# Altium schematic sheet test1SchDoc.SchDoc
size A4; SheetNumber: 1; SheetTotal: 2
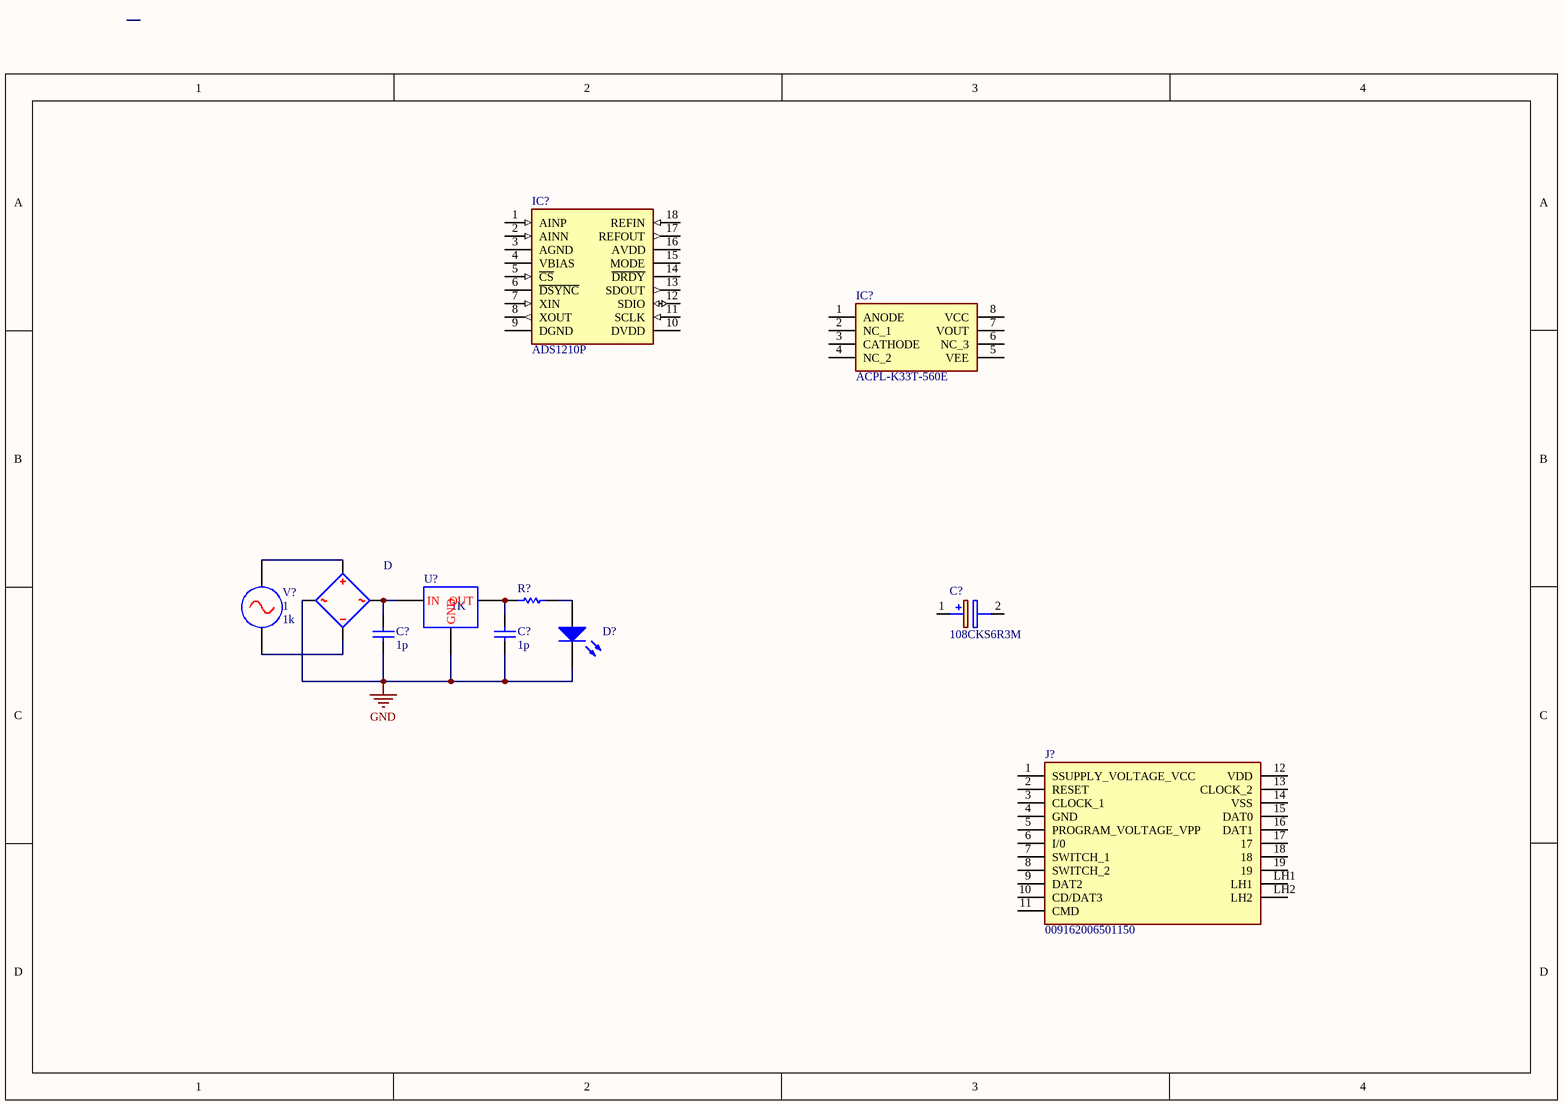
[diagram p0: test1SchDoc.SchDoc]

## Parts
(Parts that share a designator on the sheet are numbered #1, #2 ... from top to bottom, then left to right.)
C?#1  108CKS6R3M  [CAPPRD350W55D850H1300]
C?#2  value 1p  (hidden comment: Capacitor)
C?#3  value 1p  (hidden comment: Capacitor)
D  Four Diodes Bridge Rectifier  (value not drawn)
D?  Light-Emitting Diode  (value not drawn)
IC?#1  ADS1210P  [DIP794W56P254L2286H533Q18N]
IC?#2  ACPL-K33T-560E  [SOIC127P1150X361-8N]
J?  009162006501150  [009162006501150]
R?  value 1K  (hidden comment: Resistor)
U?  Positive Fixed Voltage regulator  (value not drawn)
V?  Amp: 1  Freq: 1k  (hidden comment: AC Voltage Source)

## Nets
GND: C?#2.1 C?#3.1 D.1 D?.2(K) U?.2(GND)
NetC?#2_2: C?#2.2 D.2 U?.1(IN)
NetC?#3_2: C?#3.2 R?.1 U?.3(OUT)
NetD?_1: D?.1(A) R?.2
NetD_3: D.3(POS) V?.1
NetD_4: D.4(NEG) V?.2

Not connected (* = marked no-connect by the designer): C?#1 1(+) 2(-); IC?#1 1(AINP) 2(AINN) 3(AGND) 4(VBIAS) 5(~{CS}) 6(~{DSYNC}) 7(XIN) 8(XOUT) 9(DGND) 10(DVDD) 11(SCLK) 12(SDIO) 13(SDOUT) 14(~{DRDY}) 15(MODE) 16(AVDD) 17(REFOUT) 18(REFIN); IC?#2 1(ANODE) 2(NC_1) 3(CATHODE) 4(NC_2) 5(VEE) 6(NC_3) 7(VOUT) 8(VCC); J? 1(SSUPPLY_VOLTAGE_VCC) 2(RESET) 3(CLOCK_1) 4(GND) 5(PROGRAM_VOLTAGE_VPP) 6(I/0) 7(SWITCH_1) 8(SWITCH_2) 9(DAT2) 10(CD/DAT3) 11(CMD) 12(VDD) 13(CLOCK_2) 14(VSS) 15(DAT0) 16(DAT1) 17 18 19 LH1 LH2

## Library data of the parts
C?#1 = 108CKS6R3M: Capacitor Polarised; Manufacturer_Name: ILLINOIS CAPACITOR; Datasheet Link: http://www.illinoiscapacitor.com/ic_search/lytics_products_detail.aspx?icpartnumber=247; Height: 13mm; Manufacturer_Part_Number: 108CKS6R3M; Mouser Part Number: 598-108CKS6R3M; Mouser Price/Stock: https://www.mouser.com/Search/Refine.aspx?Keyword=598-108CKS6R3M
C?#2 C?#3 = Capacitor: SimulationGenericComponent: True
D = Bridge Rectifier: area: 1; temp: 27; dtemp: 0; EG: 1.11; FC: 0.5; IBV: 100p; IS: 10f; NTUN: 30; XTITUN: 3; MJSW: 0.33; BV_MAX: 1e99; SimulationGenericComponent: True; pj: 1; AF: 1; BV: 0; CJO: 0; IBVL: 0; IKF: 0; IKR: 0; JSW: 0; JTUN: 0; JTUNSW: 0; KEG: 1; CJP: 0; FCS: 0.5; PHP: 1; ISR: 0; KF: 0; N: 1; NBV: 1; NBVL: 1; NR: 1; NS: 1; RS: 0; TBV1: 0; TBV2: 0; TIKF: 0; TRS1: 0; TRS2: 0; TT: 0; VJ: 1; XTI: 3; TNOM: 27; TM1: 0; TM2: 0; TTT1: 0; TTT2: 0; TLEV: 0; TLEVC: 0; CTA: 0; CTP: 0; TCV: 0; TVJ: 0; TPHP: 0; FV_MAX: 1e99; M: 0.5
D? = LED: AF: 1; BV: 0; BV_MAX: 1e99; EG: 1.11; FC: 0.5; IBV: 0.001; IS: 1e-14; MJSW: 0.33; NTUN: 30; TNOM: 27; XTI: 3; SimulationGenericComponent: True; CJO: 0; CJP: 0; CTA: 0; CTP: 0; FCS: 0.5; FV_MAX: 1e99; IKF: 0; IKR: 0; ISR: 1e-14; JSW: 0; JTUN: 0; JTUNSW: 0; KEG: 1; KF: 0; LEVEL: 1; N: 1; NBV: 1; NR: 1; NS: 1; PHP: 1; RS: 0; TCV: 0; TLEV: 0; TLEVC: 0; TM1: 0; TM2: 0; TPB: 0; TPHP: 0; TRS: 0; TRS2: 0; TT: 0; TTT1: 0; TTT2: 0; VJ: 1; XTITUN: 3
IC?#1 = ADS1210P: Integrated Circuit; Manufacturer_Name: Texas Instruments; Datasheet Link: https://datasheet.datasheetarchive.com/originals/distributors/Datasheets-SFU2/DSASFU100025683.pdf; Height: 5.334mm; Manufacturer_Part_Number: ADS1210P; Mouser Part Number: 595-ADS1210P; Mouser Price/Stock: https://www.mouser.com/Search/Refine.aspx?Keyword=595-ADS1210P
IC?#2 = ACPL-K33T-560E: Integrated Circuit; Manufacturer_Name: Avago Technologies; Datasheet Link: https://docs.broadcom.com/docs/AV02-4575EN; Height: 3.607mm; Manufacturer_Part_Number: ACPL-K33T-560E; Mouser Part Number: 630-ACPL-K33T-560E; Mouser Price/Stock: https://www.mouser.co.uk/ProductDetail/Broadcom-Avago/ACPL-K33T-560E?qs=etbJ0UTeUzMuvnVTAqbKJg%3D%3D
J? = 009162006501150: Connector; Manufacturer_Name: AVX; Datasheet Link: http://datasheets.avx.com/SIMMicroSDCombination.pdf; Height: 2mm; Manufacturer_Part_Number: 009162006501150; Mouser Part Number: 581-009162006501150; Mouser Price/Stock: https://www.mouser.co.uk/ProductDetail/AVX/009162006501150?qs=3oXjESXZBsAsYp3OCAqEqw%3D%3D; Arrow Part Number: 009162006501150; Arrow Price/Stock: https://www.arrow.com/en/products/009162006501150/avx
R? = Resistor: TC1: 0; SimulationGenericComponent: True; TC2: 0
U? = Linear Voltage Regulator (Fixed): Av_feedback: 1665; R1_Value: 1020; SimulationGenericComponent: True
V? = AC Voltage Source: SimulationGenericComponent: True; DC: 0; Phase: 0; Rser: 0; Cpar: 0